# EAGLE design 2-APA102-IO (EAGLE 7.4.0)
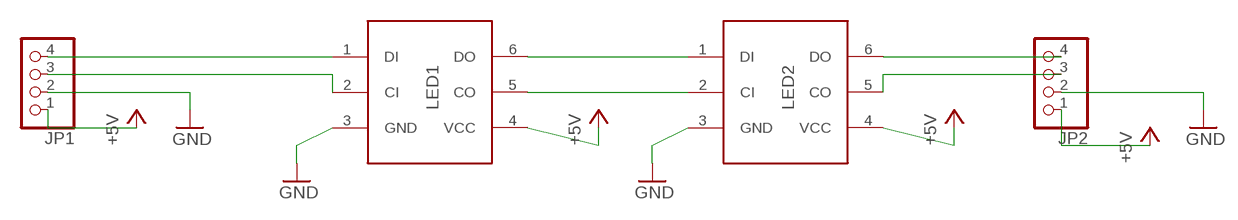
[diagram p0: schematic, sheet 1]

## Parts
JP1  PINHD-1X4  [1X04]
JP2  PINHD-1X4  [1X04]
LED1  APA1025050  [APA1025050]
LED2  APA1025050  [APA1025050]

## Nets
+5V: JP1.1 JP2.1 LED1.4(VCC) LED2.4(VCC)
GND: JP1.2 JP2.2 LED1.3(GND) LED2.3(GND)
N$1: JP1.4 LED1.1(DI)
N$2: JP1.3 LED1.2(CI)
N$3: LED1.6(DO) LED2.1(DI)
N$4: LED1.5(CO) LED2.2(CI)
N$5: JP2.3 LED2.5(CO)
N$6: JP2.4 LED2.6(DO)

## Library data of the parts
JP1 JP2 = pinhead:PINHD-1X4: PIN HEADER
LED1 LED2 = BVH-Parts:APA1025050

## Board
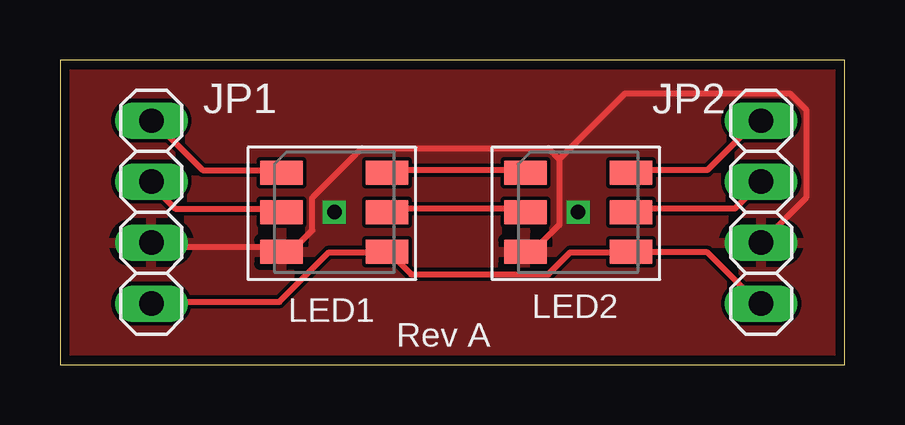
[diagram p1: board, top side]
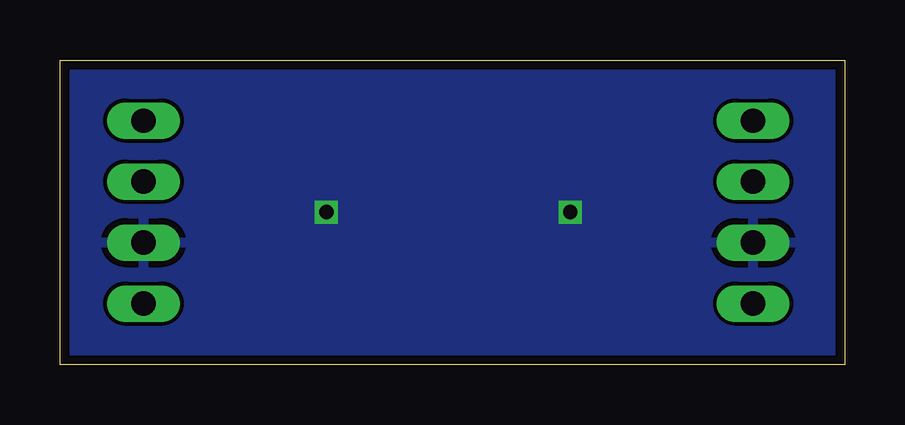
[diagram p2: board, bottom side, seen from below]

Size 32.69 x 12.69 mm. Coordinates in mm from the lower left corner, seen from the top.
Outline: 0,0 32.69,0 32.69,12.69 0,12.69 0,0
Copper layers (1*16): Top 0.0356mm / dielectric 1.5011mm / Bottom 0.0356mm
Design rules "LaenPCBOrder": minimum track width 6mil, minimum drill 13mil, track to track 6mil, track to pad 6mil, pad to pad 6mil, via to via 6mil, smd to smd 6mil, copper to edge 15mil, drill to drill 6mil, minimum pad ring 7mil, minimum via ring 7mil, stop-mask expansion 3mil, vias tented up to drill 0mil, thermal gap 10mil

### Footprints (pad centres in the part's own frame; a part is rotated, then mirrored left to right if it is on the bottom)
1X04 = drill 1.016 long: 1 -3.81,0; 2 -1.27,0; 3 1.27,0; 4 3.81,0
APA1025050 = smd 1.778 x 1: 1 -2.2,1.65; 2 -2.2,0; 3 -2.2,-1.65; 4 2.2,-1.65; 5 2.2,0; 6 2.2,1.65

### Placement (x,y rotation side)
JP1  3.81,6.35 90 top
JP2  29.21,6.35 90 top
LED1  11.43,6.35 0 top
LED2  21.59,6.35 0 top

### Tracks (layer width: path | path; a pad name or v marks a point on that pad's centre or on a via)
+5V
  Top 0.254: JP2.1 29.03,2.62 26.98,4.67 24,4.67 LED2.4 23.77,4.67 21.26,4.67 20.34,3.76 14.63,3.76 13.72,4.67 LED1.4 13.49,4.67 11.2,4.67 9.14,2.62 3.89,2.62 JP1.1
GND  (via drill 0.6)
  Top 0.254: JP1.2 3.89,4.9 9.14,4.9 LED1.3 9.37,4.9 9.83,4.9 10.52,5.59 10.52,6.96 12.57,9.02 20.34,9.02 20.8,8.56 | 20.8,8.56 20.8,5.82 19.89,4.9 19.43,4.9 LED2.3 | JP2.2 31.09,6.96 31.09,10.62 30.4,11.3 23.55,11.3 20.8,8.56
  other vias: 11.43,6.35 21.59,6.35
  pour Top: -1.27,13.97 34.29,13.97 34.29,-1.27 -1.27,-1.27
  pour Bottom: 0,13.97 34.29,13.97 34.29,-1.27 -1.27,-1.27 -1.27,13.97
N$1
  Top 0.254: LED1.1 9.14,8.1 5.94,8.1 3.89,10.16 JP1.4
N$2
  Top 0.254: LED1.2 9.14,6.5 4.8,6.5 3.89,7.42 JP1.3
N$3
  Top 0.254: LED1.6 13.72,8.1 19.2,8.1 LED2.1
N$4
  Top 0.254: LED1.5 13.72,6.5 19.2,6.5 LED2.2
N$5
  Top 0.254: LED2.5 24,6.5 28.12,6.5 29.03,7.42 JP2.3
N$6
  Top 0.254: LED2.6 24,8.1 26.98,8.1 29.03,10.16 JP2.4

### Text on the board
tNames: Rev A